# EAGLE design control-tu56 (EAGLE 5.07)

## Sheet 1 of 3
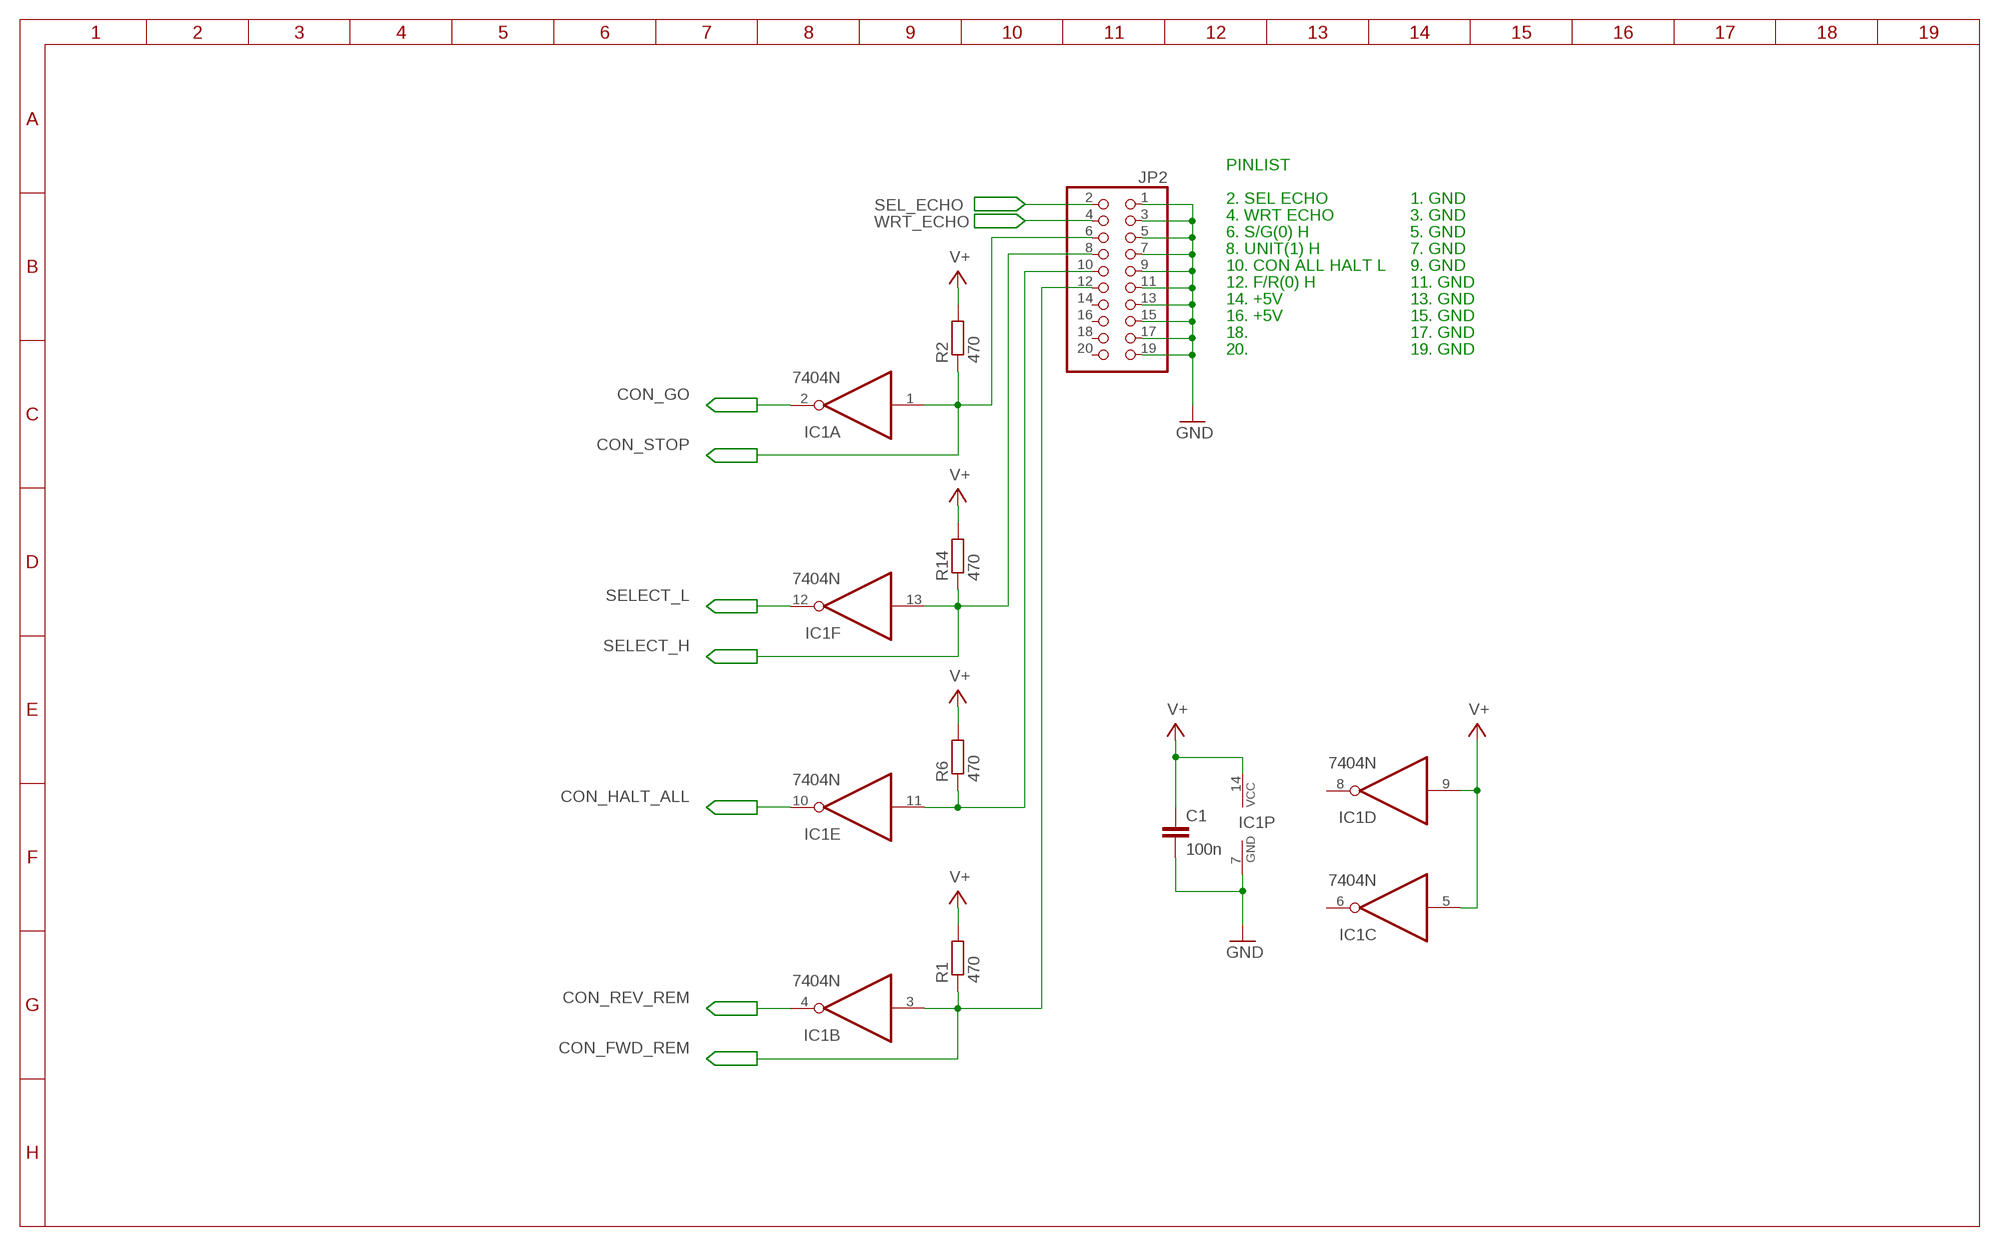
[diagram p0: schematic, sheet 1]

### Parts
C1  100n  C5/3.5  [C5B3.5]
IC1  7404N  [DIL14]
JP2  PINHD-2X10/90-FRAMED  [2Z10/90-FRAMED]
R1  470  R-EU_0207/10  [0207/10]
R2  470  R-EU_0207/10  [0207/10]
R6  470  R-EU_0207/10  [0207/10]
R14  470  R-EU_0207/10  [0207/10]

### Nets
CON_FWD_REM: IC1.3(B:I) JP2.12 R1.1 ; also sheet 3
CON_GO: IC1.2(A:O) ; also sheet 3
CON_HALT_ALL: IC1.10(E:O) ; also sheet 3
CON_REV_REM: IC1.4(B:O) ; also sheet 3
CON_STOP: IC1.1(A:I) JP2.6 R2.1 ; also sheet 3
GND: C1.2 IC1.7(P:GND) JP2.1 JP2.3 JP2.5 JP2.7 JP2.9 JP2.11 JP2.13 JP2.15 JP2.17 JP2.19 ; also sheet 3
N$4: IC1.11(E:I) JP2.10 R6.1
SEL_ECHO: JP2.2 ; also sheet 3
SELECT_H: IC1.13(F:I) JP2.8 R14.1 ; also sheet 2
SELECT_L: IC1.12(F:O) ; also sheet 2
V+: C1.1 IC1.5(C:I) IC1.9(D:I) IC1.14(P:VCC) R1.2 R2.2 R6.2 R14.2 ; also sheet 2,3
WRT_ECHO: JP2.4 ; also sheet 3
Unconnected: IC1.6(C:O) IC1.8(D:O) JP2.14 JP2.16 JP2.18 JP2.20

### Notes on the sheet
- PINLIST
- 2. SEL ECHO | 1. GND
- 4. WRT ECHO | 3. GND
- 6. S/G(0) H | 5. GND
- 8. UNIT(1) H | 7. GND
- 10. CON ALL HALT L | 9. GND
- 12. F/R(0) H | 11. GND
- 14. +5V | 13. GND
- 16. +5V | 15. GND
- 18. | 17. GND
- 20. | 19. GND

## Sheet 2 of 3
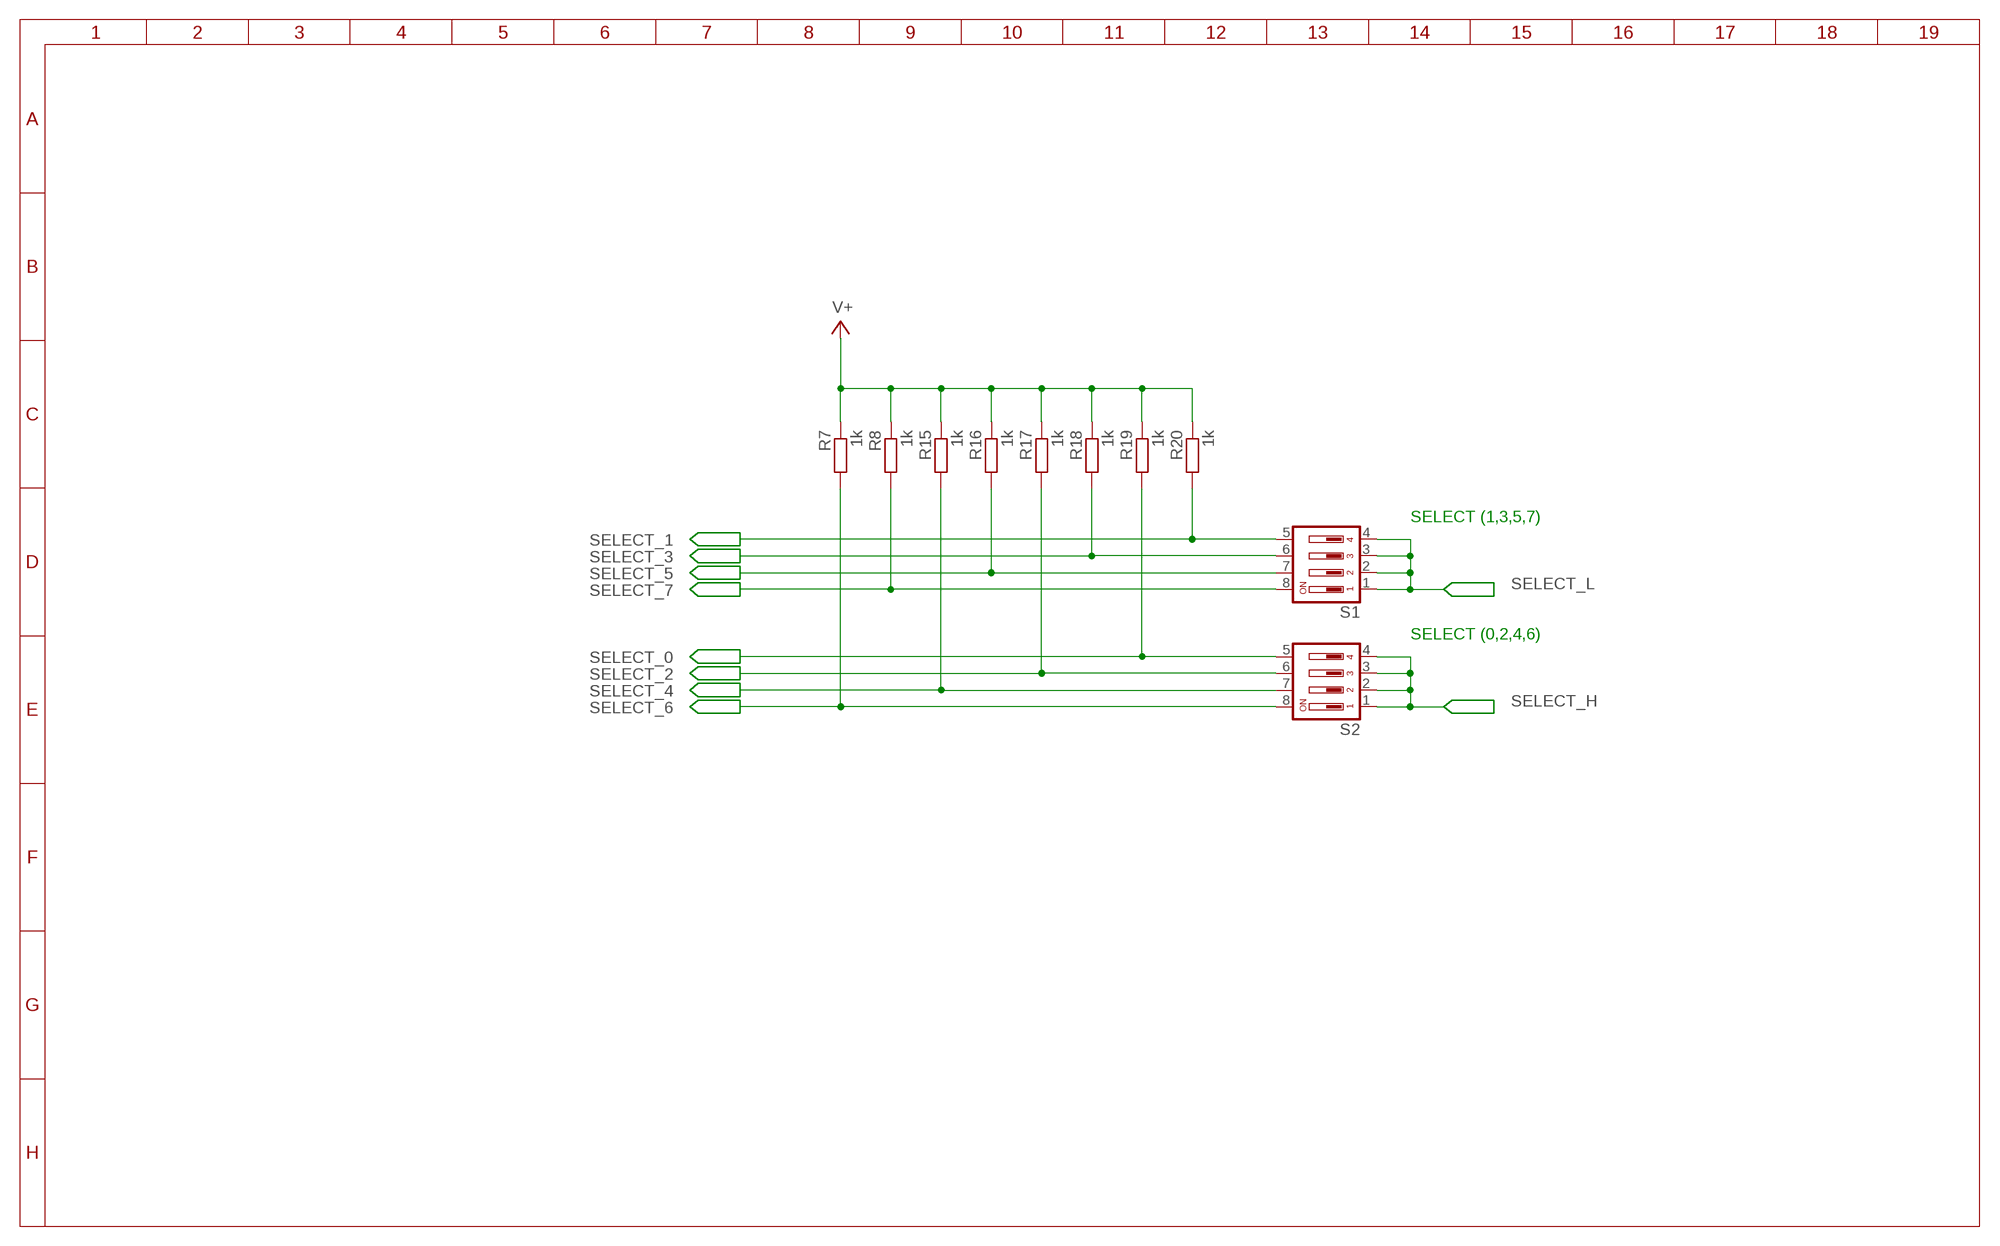
[diagram p1: schematic, sheet 2]

### Parts
R7  1k  R-EU_0207/10  [0207/10]
R8  1k  R-EU_0207/10  [0207/10]
R15  1k  R-EU_0207/10  [0207/10]
R16  1k  R-EU_0207/10  [0207/10]
R17  1k  R-EU_0207/10  [0207/10]
R18  1k  R-EU_0207/10  [0207/10]
R19  1k  R-EU_0207/10  [0207/10]
R20  1k  R-EU_0207/10  [0207/10]
S1  DIP04YL  [DIP04YL]
S2  DIP04YL  [DIP04YL]

### Nets
SELECT_0: R19.2 S2.5 ; also sheet 3
SELECT_1: R20.2 S1.5 ; also sheet 3
SELECT_2: R17.2 S2.6 ; also sheet 3
SELECT_3: R18.2 S1.6 ; also sheet 3
SELECT_4: R15.2 S2.7 ; also sheet 3
SELECT_5: R16.2 S1.7 ; also sheet 3
SELECT_6: R7.2 S2.8 ; also sheet 3
SELECT_7: R8.2 S1.8 ; also sheet 3
SELECT_H: S2.1 S2.2 S2.3 S2.4 ; also sheet 1
SELECT_L: S1.1 S1.2 S1.3 S1.4 ; also sheet 1
V+: R7.1 R8.1 R15.1 R16.1 R17.1 R18.1 R19.1 R20.1 ; also sheet 1,3

### Notes on the sheet
- SELECT (1,3,5,7)
- SELECT (0,2,4,6)

## Sheet 3 of 3
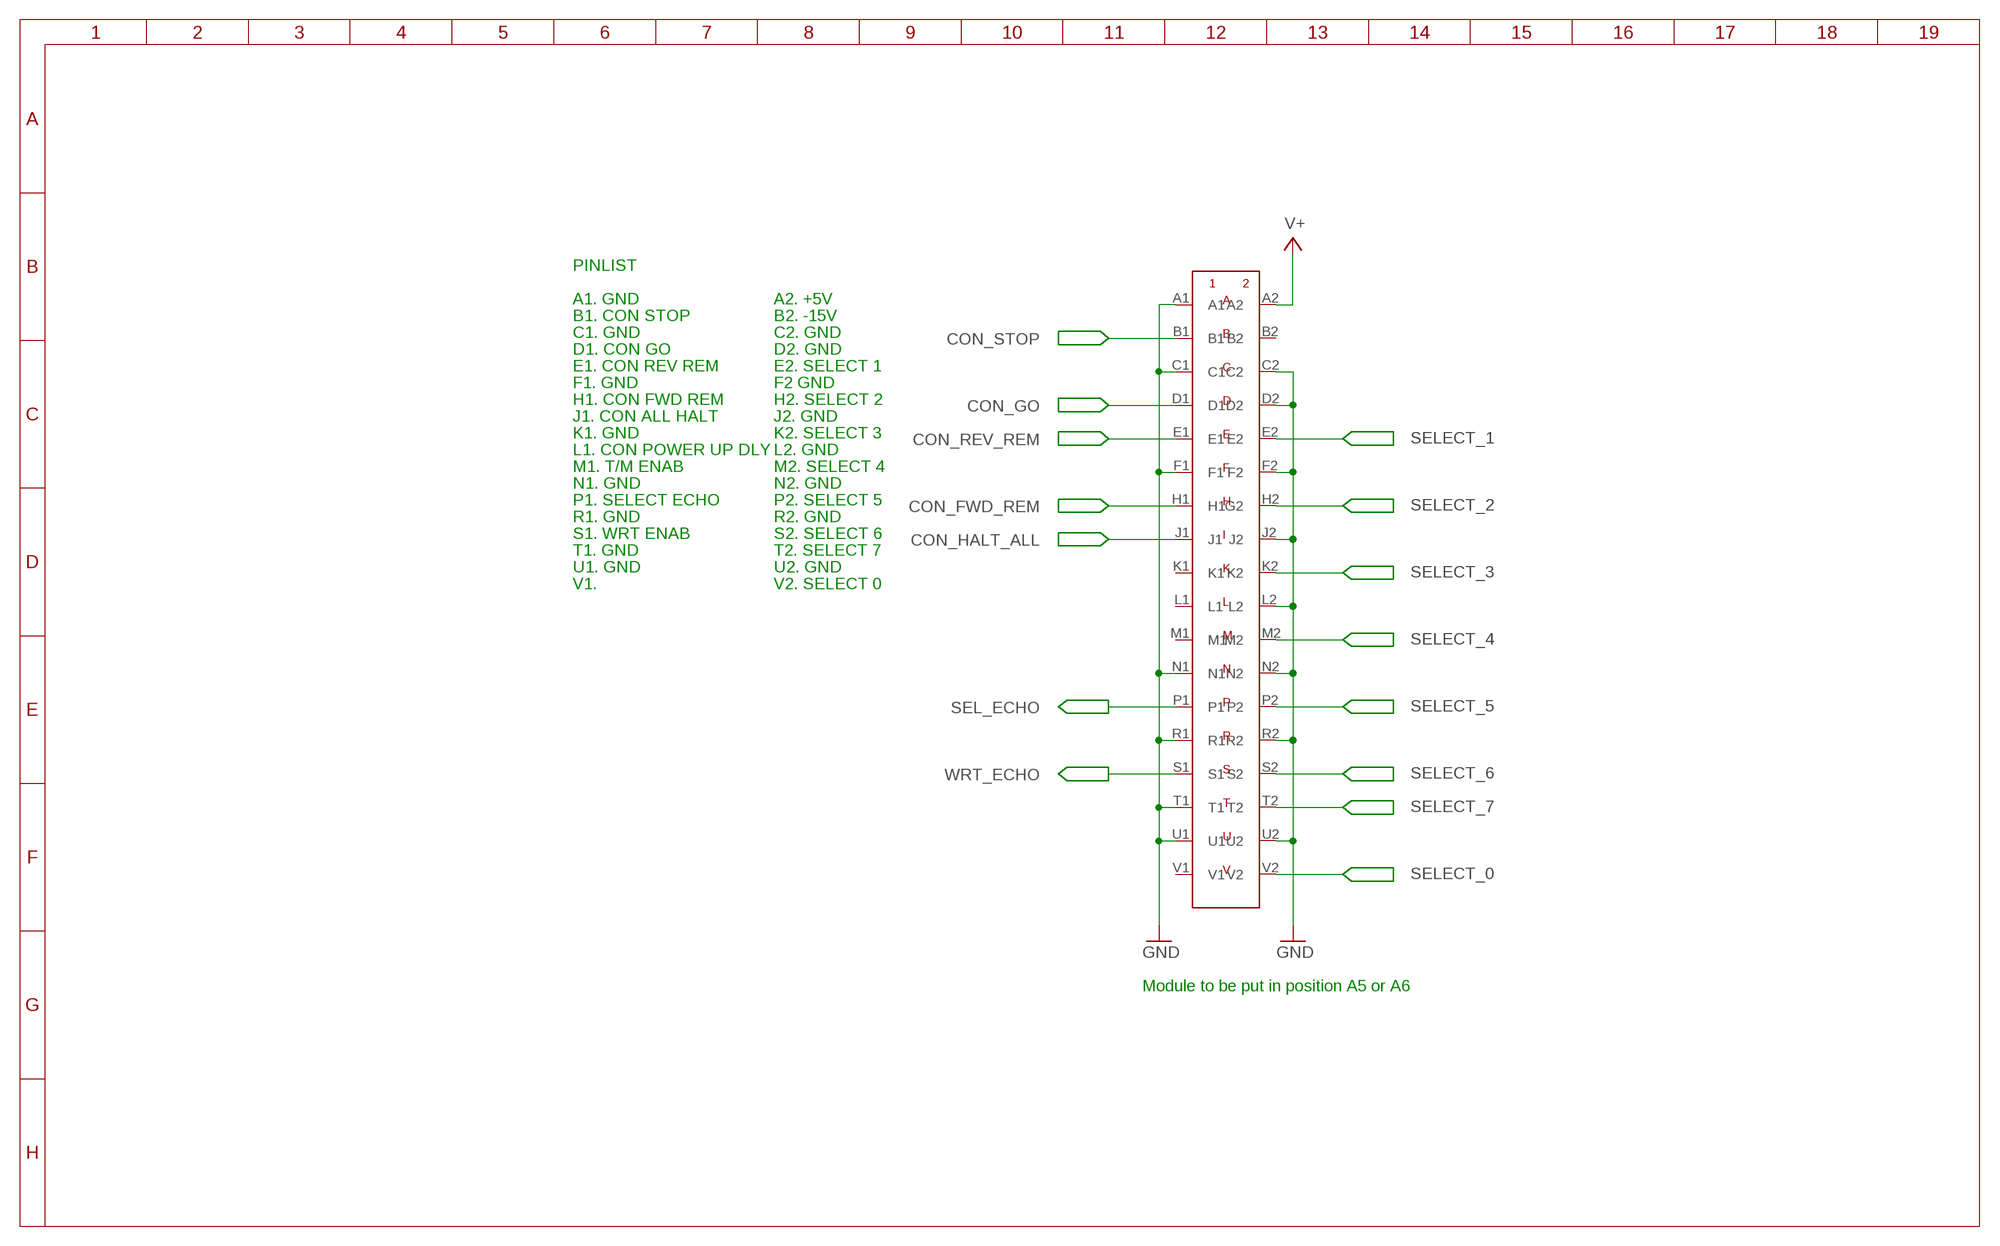
[diagram p2: schematic, sheet 3]

### Parts
CON1  FLIPCHIP_1NORMAL  [FLIPCHIP-1]

### Nets
CON_FWD_REM: CON1.H1 ; also sheet 1
CON_GO: CON1.D1 ; also sheet 1
CON_HALT_ALL: CON1.J1 ; also sheet 1
CON_REV_REM: CON1.E1 ; also sheet 1
CON_STOP: CON1.B1 ; also sheet 1
GND: CON1.A1 CON1.C1 CON1.C2 CON1.D2 CON1.F1 CON1.F2 CON1.J2 CON1.L2 CON1.N1 CON1.N2 CON1.R1 CON1.R2 CON1.T1 CON1.U1 CON1.U2 ; also sheet 1
SEL_ECHO: CON1.P1 ; also sheet 1
SELECT_0: CON1.V2 ; also sheet 2
SELECT_1: CON1.E2 ; also sheet 2
SELECT_2: CON1.H2(G2) ; also sheet 2
SELECT_3: CON1.K2 ; also sheet 2
SELECT_4: CON1.M2 ; also sheet 2
SELECT_5: CON1.P2 ; also sheet 2
SELECT_6: CON1.S2 ; also sheet 2
SELECT_7: CON1.T2 ; also sheet 2
V+: CON1.A2 ; also sheet 1,2
WRT_ECHO: CON1.S1 ; also sheet 1
Unconnected: CON1.B2 CON1.K1 CON1.L1 CON1.M1 CON1.V1

### Notes on the sheet
- PINLIST
- A1. GND | A2. +5V
- B1. CON STOP | B2. -15V
- C1. GND | C2. GND
- D1. CON GO | D2. GND
- E1. CON REV REM | E2. SELECT 1
- F1. GND | F2 GND
- H1. CON FWD REM | H2. SELECT 2
- J1. CON ALL HALT | J2. GND
- K1. GND | K2. SELECT 3
- L1. CON POWER UP DLY | L2. GND
- M1. T/M ENAB | M2. SELECT 4
- N1. GND | N2. GND
- P1. SELECT ECHO | P2. SELECT 5
- R1. GND | R2. GND
- S1. WRT ENAB | S2. SELECT 6
- T1. GND | T2. SELECT 7
- U1. GND | U2. GND
- V1. | V2. SELECT 0
- Module to be put in position A5 or A6

## Library data of the parts
C1 = anders:C: CAPACITOR naming: grid - package width
CON1 = anders:FLIPCHIP_1: DEC Digital equipment single flipchip
IC1 = 74xx-eu:74*04: Hex INVERTER
JP2 = pinhead:PINHD-2X10: PIN HEADER
R1 R2 R6-R8 R14-R20 = anders:R-EU_: RESISTOR, European symbol
S1 S2 = switch-dil:DIP04YL: DIL/CODE SWITCH

## Board
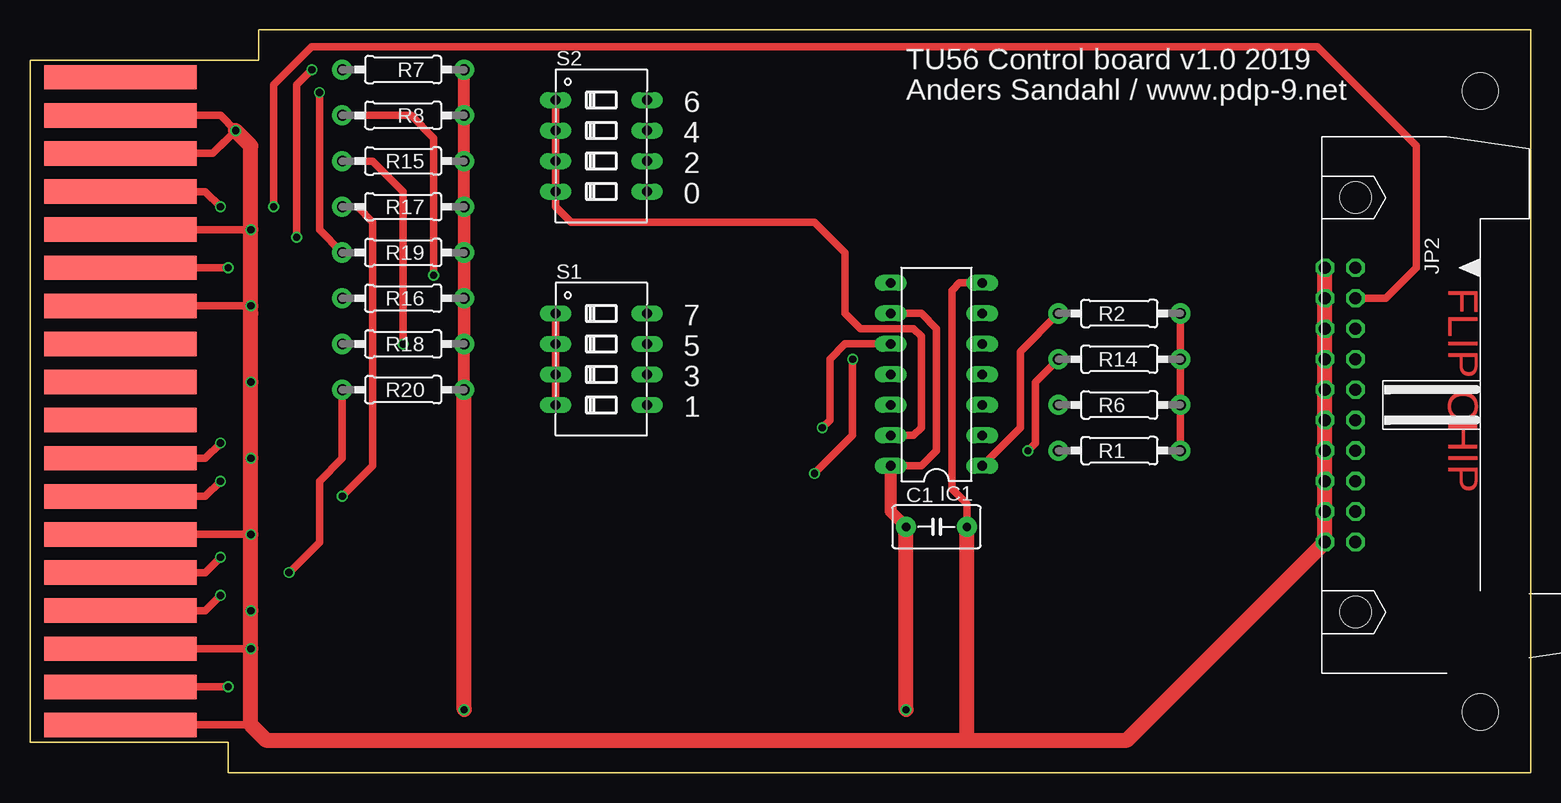
[diagram p3: board, top side]
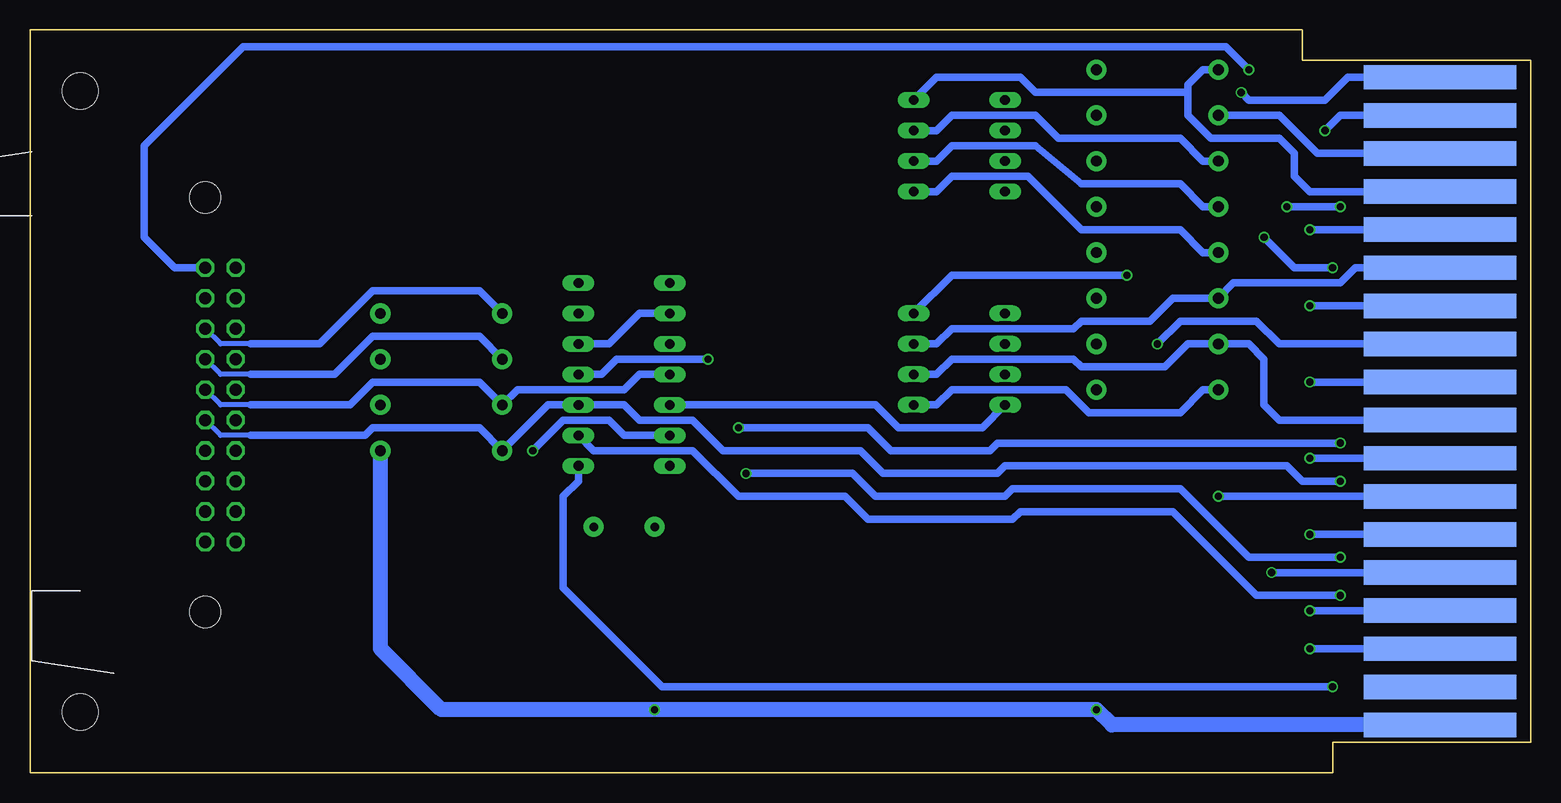
[diagram p4: board, bottom side, seen from below]

Size 125.09 x 61.91 mm. Coordinates in mm from the lower left corner, seen from the top.
Copper layers (1*16): Top 0.035mm / dielectric 1.5mm / Bottom 0.035mm
Design rules "SeeedStudio_2layer_DRU_no_angle_20140221": minimum track width 6mil, minimum drill 12mil, track to track 6mil, track to pad 6mil, pad to pad 6mil, via to via 6mil, smd to smd 0mil, copper to edge 10mil, drill to drill 10mil, minimum pad ring 10mil, minimum via ring 6mil, stop-mask expansion 2mil, vias tented up to drill 100mil, thermal gap 10mil

### Footprints (pad centres in the part's own frame; a part is rotated, then mirrored left to right if it is on the bottom)
C5B3.5 = drill 0.7 pad 1.676 round: 1 -2.54,0; 2 2.54,0
FLIPCHIP-1 = smd 12.7 x 2.032: A1 0.572,0; B1 0.572,3.175; C1 0.572,6.35; D1 0.572,9.525; E1 0.572,12.7; F1 0.572,15.875; H1 0.572,19.05; J1 0.572,22.225; K1 0.572,25.4; L1 0.572,28.575; M1 0.572,31.75; N1 0.572,34.925; P1 0.572,38.1; R1 0.572,41.275; S1 0.572,44.45; T1 0.572,47.625; U1 0.572,50.8; V1 0.572,53.975 | smd 12.7 x 2.032 bottom: A2 0.572,0; B2 0.572,3.175; C2 0.572,6.35; D2 0.572,9.525; E2 0.572,12.7; F2 0.572,15.875; H2 0.572,19.05; J2 0.572,22.225; K2 0.572,25.4; L2 0.572,28.575; M2 0.572,31.75; N2 0.572,34.925; P2 0.572,38.1; R2 0.572,41.275; S2 0.572,44.45; T2 0.572,47.625; U2 0.572,50.8; V2 0.572,53.975 | hole 3: 113.919,52.832; 113.919,1.079
DIL14 = drill 0.813 long: 1 -7.62,-3.81; 2 -5.08,-3.81; 3 -2.54,-3.81; 4 0,-3.81; 5 2.54,-3.81; 6 5.08,-3.81; 7 7.62,-3.81; 8 7.62,3.81; 9 5.08,3.81; 10 2.54,3.81; 11 0,3.81; 12 -2.54,3.81; 13 -5.08,3.81; 14 -7.62,3.81
2Z10/90-FRAMED = drill 1.016 octagon: 1 -11.43,-6.35; 2 -11.43,-3.81; 3 -8.89,-6.35; 4 -8.89,-3.81; 5 -6.35,-6.35; 6 -6.35,-3.81; 7 -3.81,-6.35; 8 -3.81,-3.81; 9 -1.27,-6.35; 10 -1.27,-3.81; 11 1.27,-6.35; 12 1.27,-3.81; 13 3.81,-6.35; 14 3.81,-3.81; 15 6.35,-6.35; 16 6.35,-3.81; 17 8.89,-6.35; 18 8.89,-3.81; 19 11.43,-6.35; 20 11.43,-3.81 | hole 2.6: 17.272,-3.81; -17.272,-3.81
0207/10 = drill 0.9 pad 1.676 round: 1 -5.08,0; 2 5.08,0
DIP04YL = drill 0.813 long: 1 -3.81,-3.81; 2 -1.27,-3.81; 3 1.27,-3.81; 4 3.81,-3.81; 5 3.81,3.81; 6 1.27,3.81; 7 -1.27,3.81; 8 -3.81,3.81

### Placement (x,y rotation side)
C1  75.56,20.51 0 top
CON1  6.99,4 0 top
IC1  75.56,33.21 90 top
JP2  114.3,30.67 270 top
R1  90.8,26.86 0 top
R2  90.8,38.29 0 top
R6  90.8,30.67 0 top
R7  31.12,58.61 180 top
R8  31.12,54.8 180 top
R14  90.8,34.48 0 top
R15  31.12,50.99 180 top
R16  31.12,39.56 180 top
R17  31.12,47.18 180 top
R18  31.12,35.75 180 top
R19  31.12,43.37 180 top
R20  31.12,31.94 180 top
S1  47.62,34.48 270 top
S2  47.62,52.26 270 top

### Tracks (layer width: path | path; a pad name or v marks a point on that pad's centre or on a via)
CON_FWD_REM  (via drill 0.6)
  Top 0.61: CON1.H1 14.61,23.05 v15.88,24.32
  Bottom 0.406: JP2.12 109.22,28.13 106.68,28.13
  Bottom 0.61: 106.68,28.13 97.16,28.13 96.52,28.77 87.63,28.77 R1.1 81.91,30.67 IC1.3 75.56,30.67 74.3,29.4 69.85,29.4 67.31,26.86 55.88,26.86 53.98,24.96 44.45,24.96 43.82,25.59 20.32,25.59 19.05,24.32 v15.88,24.32
CON_GO  (via drill 0.6)
  Top 0.61: CON1.D1 14.61,13.53 v15.88,14.8
  Bottom 0.61: v15.88,14.8 22.86,14.8 29.84,21.78 42.55,21.78 43.18,21.15 55.25,21.15 57.15,23.05 66.04,23.05 69.85,26.86 78.1,26.86 IC1.2
CON_HALT_ALL  (via drill 0.6)
  Top 0.61: CON1.J1 14.61,26.23 v15.88,27.5 | v66.04,28.77 66.67,29.4 66.67,34.48 67.94,35.75 IC1.10
  Bottom 0.61: v15.88,27.5 44.45,27.5 45.09,26.86 53.34,26.86 55.25,28.77 v66.04,28.77
CON_REV_REM  (via drill 0.6)
  Top 0.61: CON1.E1 14.61,16.7 v15.88,17.97 | v68.58,34.48 68.58,28.13 v65.41,24.96
  Bottom 0.61: v15.88,17.97 23.49,17.97 29.21,23.69 43.18,23.69 43.82,23.05 54.61,23.05 56.52,24.96 v65.41,24.96 | IC1.4 77.47,33.21 76.2,34.48 v68.58,34.48
CON_STOP  (via drill 0.6)
  Top 0.61: R2.1 82.55,35.12 82.55,28.77 IC1.1 | CON1.B1 v16.51,7.18
  Bottom 0.406: 106.68,35.75 109.22,35.75 JP2.6
  Bottom 0.61: R2.1 87.63,40.2 96.52,40.2 100.96,35.75 106.68,35.75 | v16.51,7.18 72.39,7.18 80.64,15.43 80.64,23.05 79.38,24.32 IC1.1
GND  (via drill 0.6)
  Top 0.61: C1.2 78.1,22.42 76.83,23.69 76.83,40.2 77.47,40.83 IC1.7 | CON1.A1 18.41,4 | v18.41,10.35 CON1.C1 | v18.41,19.88 CON1.F1 | v18.41,38.93 CON1.N1 | CON1.R1 v18.41,45.28 18.41,38.29 | CON1.U1 15.88,54.8 v17.15,53.53 | v17.15,53.53 15.24,51.63 CON1.T1 | v17.15,53.53 15.88,52.26
  Top 1.27: JP2.1 JP2.3 JP2.5 JP2.7 JP2.9 JP2.11 JP2.13 JP2.15 JP2.17 JP2.19 91.44,2.73 78.1,2.73 | v17.15,53.53 18.41,52.26 v18.41,45.28 v18.41,38.93 18.41,38.29 v18.41,32.58 v18.41,26.23 v18.41,19.88 v18.41,13.53 v18.41,10.35 18.41,4 19.69,2.73 78.1,2.73 | 78.1,2.73 C1.2
  Bottom 0.61: v18.41,13.53 CON1.D2 | v18.41,10.35 CON1.C1 | v18.41,19.88 CON1.F1 | v18.41,26.23 CON1.J2 | v18.41,32.58 CON1.L2 | v18.41,38.93 CON1.N1 | v18.41,45.28 CON1.R1 | CON1.U1 15.88,54.8 v17.15,53.53
N$4
  Bottom 0.406: JP2.10 109.22,30.67 106.68,30.67
  Bottom 0.61: 106.68,30.67 98.42,30.67 96.52,32.58 87.63,32.58 R6.1 84.45,31.94 75.56,31.94 74.3,33.21 IC1.11
SEL_ECHO  (via drill 0.6)
  Top 0.61: CON1.P1 v16.51,42.1 | v22.23,44.64 22.23,57.34 v23.49,58.61
  Bottom 0.61: JP2.2 113.03,42.1 115.57,44.64 115.57,52.26 107.31,60.52 25.4,60.52 v23.49,58.61 | v16.51,42.1 19.69,42.1 v22.23,44.64
SELECT_0  (via drill 0.6)
  Top 0.61: v24.13,56.71 24.13,45.28 R19.2
  Bottom 0.61: CON1.V2 15.24,57.98 17.15,56.07 23.49,56.07 v24.13,56.71 | R19.2 27.3,43.37 29.21,45.28 37.47,45.28 41.91,49.72 48.26,49.72 49.53,48.45 S2.5
SELECT_1  (via drill 0.6)
  Top 0.61: R20.2 26.04,26.23 24.13,24.32 24.13,19.24 v21.59,16.7
  Bottom 0.61: S1.5 49.53,30.67 48.26,31.94 38.73,31.94 36.83,30.04 29.21,30.04 27.3,31.94 R20.2 | CON1.E2 v21.59,16.7
SELECT_2  (via drill 0.6)
  Top 0.61: R17.2 27.3,47.18 28.58,45.91 28.58,25.59 v26.04,23.05
  Bottom 0.61: S2.6 49.53,50.99 48.26,52.26 41.27,52.26 37.47,49.09 29.21,49.09 27.3,47.18 R17.2 | CON1.H2 v26.04,23.05
SELECT_3
  Bottom 0.61: S1.6 49.53,33.21 48.26,34.48 38.1,34.48 37.47,33.85 30.48,33.85 28.58,35.75 R18.2 23.49,35.75 22.23,34.48 22.23,30.67 20.95,29.4 CON1.K2
SELECT_4  (via drill 0.6)
  Top 0.61: v31.12,35.75 31.12,48.45 28.58,50.99 R15.2
  Bottom 0.61: R15.2 27.3,50.99 29.21,52.9 39.37,52.9 41.27,54.8 48.26,54.8 49.53,53.53 S2.7 | CON1.M2 20.95,35.75 22.86,37.66 29.21,37.66 v31.12,35.75
SELECT_5
  Bottom 0.61: CON1.P2 14.61,42.1 15.88,40.83 24.77,40.83 R16.2 29.84,39.56 31.75,37.66 37.47,37.66 38.1,37.02 48.26,37.02 49.53,35.75 S1.7
SELECT_6
  Bottom 0.61: R7.2 27.3,58.61 28.58,57.34 28.58,56.71 | 28.58,56.71 28.58,54.8 26.67,52.9 20.95,52.9 19.69,51.63 19.69,49.72 18.41,48.45 CON1.S2 | S2.8 49.53,57.98 42.55,57.98 41.27,56.71 28.58,56.71
SELECT_7  (via drill 0.6)
  Top 0.61: R8.2 31.75,54.8 33.66,52.9 v33.66,41.47
  Bottom 0.61: CON1.T2 17.78,51.63 20.95,54.8 R8.2 | v33.66,41.47 48.26,41.47 S1.8
SELECT_H  (via drill 0.6)
  Top 0.61: S2.1 S2.2 S2.3 S2.4 43.82,47.18 45.09,45.91 65.41,45.91 67.94,43.37 67.94,38.29 69.21,37.02 73.66,37.02 74.3,36.39 74.3,28.77 73.66,28.13 IC1.13 | R14.1 83.82,32.58 83.82,27.5 v83.18,26.86
  Bottom 0.406: JP2.8 109.22,33.21 106.68,33.21 106.05,33.21
  Bottom 0.61: R14.1 87.63,36.39 96.52,36.39 99.69,33.21 106.68,33.21 | v83.18,26.86 80.64,29.4 76.83,29.4 75.56,28.13 IC1.13
SELECT_L
  Top 0.61: S1.4 S1.3 S1.2 S1.1
  Bottom 0.61: IC1.12 54.61,30.67 52.71,28.77 45.72,28.77 S1.4
V+  (via drill 0.6)
  Top 0.61: R14.2 R2.2 | R14.2 R6.2 R1.2 R14.2 | IC1.14 74.3,25.59 75.56,26.86 75.56,37.02 74.3,38.29 IC1.9
  Top 1.016: IC1.14 71.75,21.78 C1.1 | R7.1 R8.1 R15.1 R16.1 R17.1 R18.1 R19.1 R20.1
  Top 1.27: v36.2,5.27 R20.1 | v73.02,5.27 C1.1
  Bottom 0.61: IC1.5 76.83,35.75 74.3,38.29 IC1.9
  Bottom 1.27: CON1.A2 34.93,4 v36.2,5.27 v73.02,5.27 90.8,5.27 95.88,10.35 R1.2
WRT_ECHO  (via drill 0.6)
  Top 0.61: v20.32,47.18 20.32,57.34 23.49,60.52 107.31,60.52 115.57,52.26 115.57,42.1 113.03,39.56 JP2.4 | CON1.S1 14.61,48.45 v15.88,47.18
  Bottom 0.61: v15.88,47.18 v20.32,47.18

### Text on the board
tNames: TU56 Control board v1.0 2019 | Anders Sandahl / www.pdp-9.net | 6 | 4 | 2 | 0 | 7 | 5 | 3 | 1